# Altium schematic sheet ETH.SchDoc
size A3
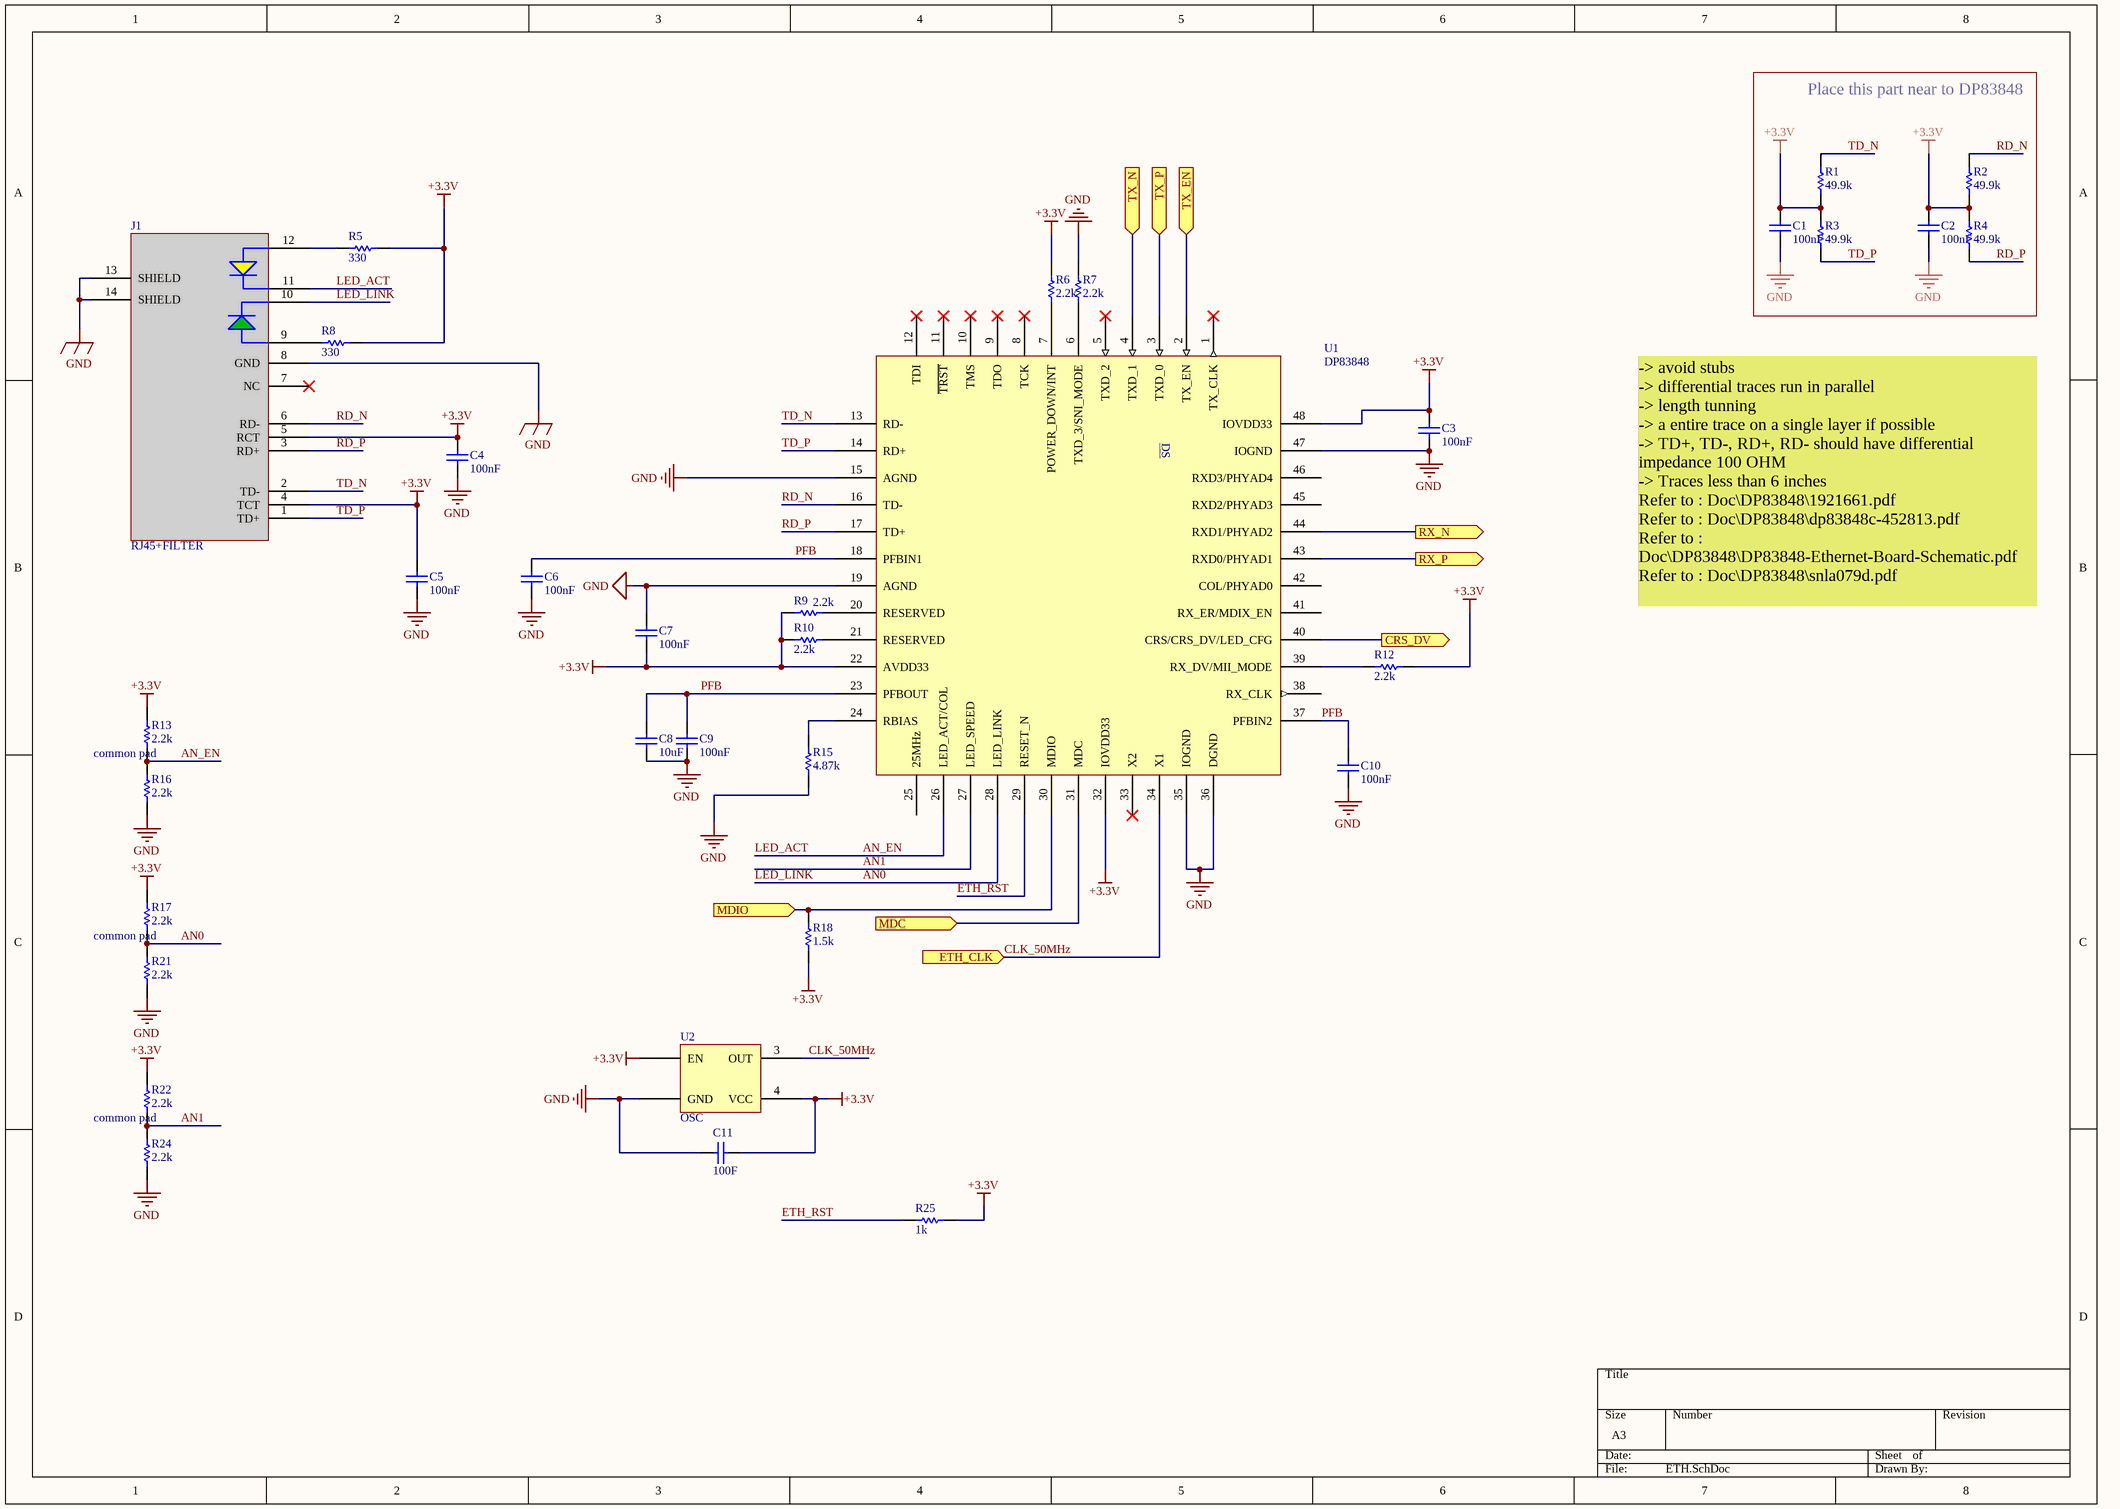
[diagram p0: ETH.SchDoc]

## Parts
C1  value 100nF  [C-805]  (hidden comment: C-805)
C2  value 100nF  [C-805]  (hidden comment: C-805)
C3  value 100nF  [C-805]  (hidden comment: C-805)
C4  value 100nF  [C-805]  (hidden comment: C-805)
C5  value 100nF  [C-805]  (hidden comment: C-805)
C6  value 100nF  [C-805]  (hidden comment: C-805)
C7  value 100nF  [C-805]  (hidden comment: C-805)
C8  value 10uF  [C-805]  (hidden comment: C-805)
C9  value 100nF  [C-805]  (hidden comment: C-805)
C10  value 100nF  [C-805]  (hidden comment: C-805)
C11  value 100F  [C-805]  (hidden comment: C-805)
J1  RJ45+FILTER  [RJ45]
R1  value 49.9k  [R-805]  (hidden comment: R-805)
R2  value 49.9k  [R-805]  (hidden comment: R-805)
R3  value 49.9k  [R-805]  (hidden comment: R-805)
R4  value 49.9k  [R-805]  (hidden comment: R-805)
R5  value 330  [R-805]  (hidden comment: R-805)
R6  value 2.2k  [R-805]  (hidden comment: R-805)
R7  value 2.2k  [R-805]  (hidden comment: R-805)
R8  value 330  [R-805]  (hidden comment: R-805)
R9  value 2.2k  [R-805]  (hidden comment: R-805)
R10  value 2.2k  [R-805]  (hidden comment: R-805)
R12  value 2.2k  [R-805]  (hidden comment: R-805)
R13  value 2.2k  [R-805]  (hidden comment: R-805)
R15  value 4.87k  [R-805]  (hidden comment: R-805)
R16  value 2.2k  [R-805]  (hidden comment: R-805)
R17  value 2.2k  [R-805]  (hidden comment: R-805)
R18  value 1.5k  [R-805]  (hidden comment: R-805)
R21  value 2.2k  [R-805]  (hidden comment: R-805)
R22  value 2.2k  [R-805]  (hidden comment: R-805)
R24  value 2.2k  [R-805]  (hidden comment: R-805)
R25  value 1k  [R-805]  (hidden comment: R-805)
U1  DP83848  [DP83848]
U2  OSC  [OSC]

## Blocks framed on the sheet
Place this part near to DP83848: C1 C2 R1-R4

## Ports
CRS_DV (out), ETH_CLK (in), MDC (in), MDIO (in), RX_N (out), RX_P (out), TX_EN (in), TX_N (in), TX_P (in)

## Nets
+3.3V: C1.2 C2.2 C3.2 C4.2 C5.2 C7.1 C11.2 J1.4(TCT) J1.5(RCT) R1.1 R2.1 R3.2 R4.2 R5.1 R6.2 R8.1 R9.2 R10.2 R12.1 R13.2 R17.2 R18.1 R22.2 R25.1 U1.22(AVDD33) U1.32(IOVDD33) U1.48(IOVDD33) U2.1(EN) U2.4(VCC)
GND: C1.1 C2.1 C3.1 C4.1 C5.1 C6.1 C7.2 C8.1 C9.1 C10.1 C11.1 J1.8(GND) J1.13(SHIELD) J1.14(SHIELD) R7.2 R15.1 R16.1 R21.1 R24.1 U1.15(AGND) U1.19(AGND) U1.35(IOGND) U1.36(DGND) U1.47(IOGND) U2.2(GND)
AN0: J1.10 R17.1 R21.2 U1.28(LED_LINK)  [also labelled LED_LINK]
AN1: R22.1 R24.2 U1.27(LED_SPEED)
AN_EN: J1.11 R13.1 R16.2 U1.26(LED_ACT/COL)  [also labelled LED_ACT]
CLK_50MHz: U1.34(X1) U2.3(OUT) ; port ETH_CLK
CRS_DV: U1.40(CRS/CRS_DV/LED_CFG) ; port CRS_DV
ETH_RST: R25.2 U1.29(RESET_N)
MDC: U1.31(MDC) ; port MDC
MDIO: R18.2 U1.30(MDIO) ; port MDIO
PFB: C6.2 C8.2 C9.2 C10.2 U1.18(PFBIN1) U1.23(PFBOUT) U1.37(PFBIN2)
RD_N: J1.6(RD-) R2.2 U1.16(TD-)
RD_P: J1.3(RD+) R4.1 U1.17(TD+)
RX_N: U1.44(RXD1/PHYAD2) ; port RX_N
RX_P: U1.43(RXD0/PHYAD1) ; port RX_P
TD_N: J1.2(TD-) R1.2 U1.13(RD-)
TD_P: J1.1(TD+) R3.1 U1.14(RD+)
TX_EN: U1.2(TX_EN) ; port TX_EN
TX_N: U1.4(TXD_1) ; port TX_N
TX_P: U1.3(TXD_0) ; port TX_P
NetJ1_9: J1.9 R8.2
NetJ1_12: J1.12 R5.2
NetR6_1: R6.1 U1.7(POWER_DOWN/INT)
NetR7_1: R7.1 U1.6(TXD_3/SNI_MODE)
NetR9_1: R9.1 U1.20(RESERVED)
NetR10_1: R10.1 U1.21(RESERVED)
NetR12_2: R12.2 U1.39(RX_DV/MII_MODE)
NetR15_2: R15.2 U1.24(RBIAS)

Not connected (* = marked no-connect by the designer): J1 7(NC)*; U1 1(TX_CLK)* 5(TXD_2)* 8(TCK)* 9(TDO)* 10(TMS)* 11(~{TRST})* 12(TDI)* 25(25MHz) 33(X2)* 38(RX_CLK) 41(RX_ER/MDIX_EN) 42(COL/PHYAD0) 45(RXD2/PHYAD3) 46(RXD3/PHYAD4)

## Notes on the sheet
- -> avoid stubs
  -> differential traces run in parallel
  -> length tunning
  -> a entire trace on a single layer if possible
  -> TD+, TD-, RD+, RD- should have differential impedance 100 OHM
  -> Traces less than 6 inches
  Refer to : Doc\DP83848\1921661.pdf
  Refer to : Doc\DP83848\dp83848c-452813.pdf
  Refer to : Doc\DP83848\DP83848-Ethernet-Board-Schematic.pdf
  Refer to : Doc\DP83848\snla079d.pdf
- (near R13) common pad
- (near R17) common pad
- (near R22) common pad
- (in symbol DP83848) DS

## Library data of the parts
C1-C11 = C-805: Capacitor; Published: 8-Jun-2000; LatestRevisionDate: 29-May-2009; LatestRevisionNote: IPC-7351 Footprint Added.; PackageReference: C1206; Publisher: Altium Limited; PackageDescription: Chip Capacitor
J1 = RJ45+FILTER: RJ45 JACK
R1-R10 R12 R13 R15-R18 R21 R22 R24 R25 = R-805: Resistor
U1 = DP83848: ETHERNET PHY